# EAGLE schematic Main (EAGLE 9.6.2)
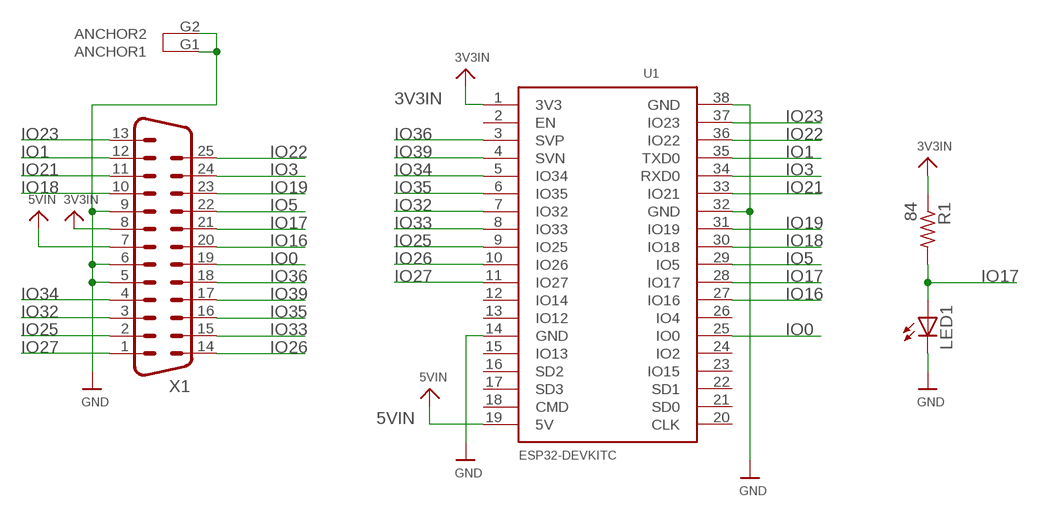
[diagram p0: schematic, sheet 1]

## Parts
LED1  LEDCHIPLED_1206  [CHIPLED_1206]
R1  84  R-US_R1206  [R1206]
U1  ESP32DEVKITC  [ESP32-DEVKITC]
X1  DB25_MALEHP  [M25HP]

## Nets
3V3IN: R1.1 U1.1(3V3) X1.8
5VIN: U1.19(5V) X1.7
GND: LED1.C U1.14(GND) U1.32(GND) U1.38(GND) X1.5 X1.6 X1.9 X1.G1(ANCHOR1) X1.G2(ANCHOR2)
IO0: U1.25(IO0) X1.19
IO1: U1.35(TXD0) X1.12
IO3: U1.34(RXD0) X1.24
IO5: U1.29(IO5) X1.22
IO16: U1.27(IO16) X1.20
IO17: LED1.A R1.2 U1.28(IO17) X1.21
IO18: U1.30(IO18) X1.10
IO19: U1.31(IO19) X1.23
IO21: U1.33(IO21) X1.11
IO22: U1.36(IO22) X1.25
IO23: U1.37(IO23) X1.13
IO25: U1.9(IO25) X1.2
IO26: U1.10(IO26) X1.14
IO27: U1.11(IO27) X1.1
IO32: U1.7(IO32) X1.3
IO33: U1.8(IO33) X1.15
IO34: U1.5(IO34) X1.4
IO35: U1.6(IO35) X1.16
IO36: U1.3(SVP) X1.18
IO39: U1.4(SVN) X1.17
Unconnected: U1.2(EN) U1.12(IO14) U1.13(IO12) U1.15(IO13) U1.16(SD2) U1.17(SD3) U1.18(CMD) U1.20(CLK) U1.21(SD0) U1.22(SD1) U1.23(IO15) U1.24(IO2) U1.26(IO4)

## Library data of the parts
LED1 = adafruit:LED: LED OSRAM: - CHIPLED LG R971, LG N971, LY N971, LG Q971, LY Q971, LO R971, LY R971 LH N974, LH R974 LS Q976, LO Q976, LY Q976 LO Q996 - Hyper CHIPLED LW Q18S LB Q993, LB Q99A, LB R99A - SideLED LS A670, LO A670, LY A670, LG A670, LP A670 LB A673, LV A673, LT A673, LW A673 LH A674 LY A675 LS A676, LA A676, LO A676, LY A676, LW A676 LS A679, LY A679, LG A679 - Hyper Micro SIDELED® LS Y876, LA Y876, LO Y876, LY Y876 LT Y87S - SmartLED LW L88C, LW L88S LB L89C, LB L89S, LG L890 LS L89K, LO L89K, LY L89K LS L896, LA L896, LO L896, LY L896 - TOPLED LS T670, LO T670, LY T670, LG T670, LP T670 LSG T670, LSP T670, LSY T670, LOP T670, LYG T670 LG T671, LOG T671, LSG T671 LB T673, LV T673, LT T673, LW T673 LH T674 LS T676, LA T676, LO T676, LY T676, LB T676, LH T676, LSB T676, LW T676 LB T67C, LV T67C, LT T67C, LS T67K, LO T67K, LY T67K, LW E67C LS E67B, LA E67B, LO E67B, LY E67B, LB E67C, LV E67C, LT E67C LW T67C LS T679, LY T679, LG T679 LS T770, LO T770, LY T770, LG T770, LP T770 LB T773, LV T773, LT T773, LW T773 LH T774 LS E675, LA E675, LY E675, LS T675 LS T776, LA T776, LO T776, LY T776, LB T776 LHGB T686 LT T68C, LB T68C - Hyper Mini TOPLED® LB M676 - Mini TOPLED Santana® LG M470 LS M47K, LO M47K, LY M47K Source: http://www.osram.convergy.de/
R1 = adafruit:R-US_: RESISTOR, American symbol
U1 = ESP32-DEVKITC:ESP32DEVKITC
X1 = SparkFun-Retired:DB25_MALE: Various DB25 connectors